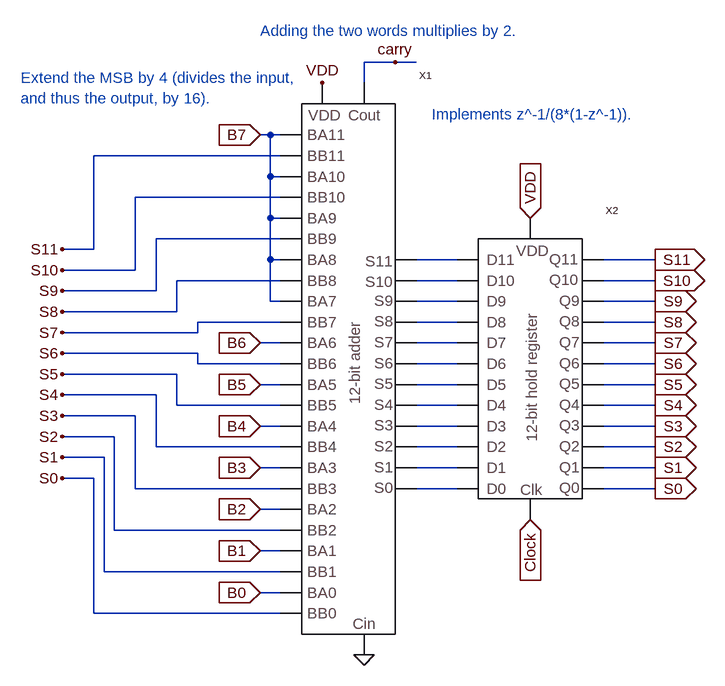
[diagram p0: schematic Integrator_delaying.asc]
Integrator_delaying.asc, the LTspice schematic file:
Version 4
SHEET 1 1852 932
WIRE 288 -1152 240 -1152
WIRE 320 -1152 288 -1152
WIRE 240 -1120 240 -1152
WIRE 96 -1040 80 -1040
WIRE 112 -1040 96 -1040
WIRE 112 -1008 -176 -1008
WIRE 96 -976 96 -1040
WIRE 112 -976 96 -976
WIRE 112 -944 -112 -944
WIRE 96 -912 96 -976
WIRE 112 -912 96 -912
WIRE 112 -880 -80 -880
WIRE -176 -864 -176 -1008
WIRE -176 -864 -224 -864
WIRE 96 -848 96 -912
WIRE 112 -848 96 -848
WIRE 384 -848 320 -848
WIRE 688 -848 608 -848
WIRE -112 -832 -112 -944
WIRE -112 -832 -224 -832
WIRE 112 -816 -48 -816
WIRE 384 -816 320 -816
WIRE 688 -816 608 -816
WIRE -80 -800 -80 -880
WIRE -80 -800 -224 -800
WIRE 96 -784 96 -848
WIRE 112 -784 96 -784
WIRE 384 -784 320 -784
WIRE 688 -784 608 -784
WIRE -48 -768 -48 -816
WIRE -48 -768 -224 -768
WIRE 112 -752 -16 -752
WIRE 384 -752 320 -752
WIRE 688 -752 608 -752
WIRE -16 -736 -16 -752
WIRE -16 -736 -224 -736
WIRE 112 -720 80 -720
WIRE 384 -720 320 -720
WIRE 688 -720 608 -720
WIRE -16 -704 -224 -704
WIRE -16 -688 -16 -704
WIRE 112 -688 -16 -688
WIRE 384 -688 320 -688
WIRE 688 -688 608 -688
WIRE -48 -672 -224 -672
WIRE 112 -656 80 -656
WIRE 384 -656 320 -656
WIRE 688 -656 608 -656
WIRE -80 -640 -224 -640
WIRE -48 -624 -48 -672
WIRE 112 -624 -48 -624
WIRE 384 -624 320 -624
WIRE 688 -624 608 -624
WIRE -112 -608 -224 -608
WIRE 112 -592 80 -592
WIRE 384 -592 320 -592
WIRE 688 -592 608 -592
WIRE -144 -576 -224 -576
WIRE -80 -560 -80 -640
WIRE 112 -560 -80 -560
WIRE 384 -560 320 -560
WIRE 688 -560 608 -560
WIRE -160 -544 -224 -544
WIRE 112 -528 80 -528
WIRE 384 -528 320 -528
WIRE 688 -528 608 -528
WIRE -176 -512 -224 -512
WIRE -112 -496 -112 -608
WIRE 112 -496 -112 -496
WIRE 384 -496 320 -496
WIRE 688 -496 608 -496
WIRE 112 -464 80 -464
WIRE -144 -432 -144 -576
WIRE 112 -432 -144 -432
WIRE 112 -400 80 -400
WIRE -160 -368 -160 -544
WIRE 112 -368 -160 -368
WIRE 112 -336 80 -336
WIRE -176 -304 -176 -512
WIRE 112 -304 -176 -304
FLAG 80 -720 B6
IOPIN 80 -720 In
FLAG 80 -656 B5
IOPIN 80 -656 In
FLAG 80 -592 B4
IOPIN 80 -592 In
FLAG 80 -528 B3
IOPIN 80 -528 In
FLAG 80 -464 B2
IOPIN 80 -464 In
FLAG 80 -400 B1
IOPIN 80 -400 In
FLAG 80 -336 B0
IOPIN 80 -336 In
FLAG 80 -1040 B7
IOPIN 80 -1040 In
FLAG 176 -1120 VDD
FLAG 240 -240 0
FLAG 496 -912 VDD
IOPIN 496 -912 In
FLAG 496 -448 Clock
IOPIN 496 -448 In
FLAG 688 -848 S11
IOPIN 688 -848 Out
FLAG 688 -816 S10
IOPIN 688 -816 Out
FLAG 688 -784 S9
IOPIN 688 -784 Out
FLAG 688 -752 S8
IOPIN 688 -752 Out
FLAG 688 -720 S7
IOPIN 688 -720 Out
FLAG 688 -688 S6
IOPIN 688 -688 Out
FLAG 688 -656 S5
IOPIN 688 -656 Out
FLAG 688 -624 S4
IOPIN 688 -624 Out
FLAG 688 -592 S3
IOPIN 688 -592 Out
FLAG 688 -560 S2
IOPIN 688 -560 Out
FLAG 688 -528 S1
IOPIN 688 -528 Out
FLAG 688 -496 S0
IOPIN 688 -496 Out
FLAG -224 -864 S11
FLAG -224 -832 S10
FLAG -224 -800 S9
FLAG -224 -768 S8
FLAG -224 -736 S7
FLAG -224 -704 S6
FLAG -224 -672 S5
FLAG -224 -640 S4
FLAG -224 -608 S3
FLAG -224 -576 S2
FLAG -224 -544 S1
FLAG -224 -512 S0
FLAG 288 -1152 carry
SYMBOL 12_bit_adder 144 -272 R0
SYMATTR InstName X1
SYMBOL 12_bit_register 416 -480 R0
SYMATTR InstName X2
TEXT 344 -1072 Left 0 ;Implements z^-1/(8*(1-z^-1)).
TEXT -288 -1128 Left 0 ;Extend the MSB by 4 (divides the input, \nand thus the output, by 16).
TEXT 80 -1200 Left 0 ;Adding the two words multiplies by 2.

The netlist it stands for:
* Integrator_delaying.asc
XX1 VDD B0 S0 B1 S1 B2 S2 B3 S3 B4 S4 B5 S5 B6 S6 B7 S7 N012 carry 0 N011 N010 N009 N008 N007 N006 N005 N004 N003 N002 N001 B7 S8 B7 S9 B7 S10 B7 S11 12_bit_adder  ; pins VDD BA0 BB0 BA1 BB1 BA2 BB2 BA3 BB3 BA4 BB4 BA5 BB5 BA6 BB6 BA7 BB7 S0 Cout Cin S1 S2 S3 S4 S5 S6 S7 S8 S9 S10 S11 BA8 BB8 BA9 BB9 BA10 BB10 BA11 BB11
XX2 N012 N011 N010 N009 N008 N007 N006 N005 N004 N003 N002 N001 S0 S1 S2 S3 S4 S5 S6 S7 S8 S9 S10 S11 Clock VDD 12_bit_register  ; pins D0 D1 D2 D3 D4 D5 D6 D7 D8 D9 D10 D11 Q0 Q1 Q2 Q3 Q4 Q5 Q6 Q7 Q8 Q9 Q10 Q11 Clk VDD
* Implements z^-1/(8*(1-z^-1)).
* Extend the MSB by 4 (divides the input,
* and thus the output, by 16).
* Adding the two words multiplies by 2.
.backanno
.end